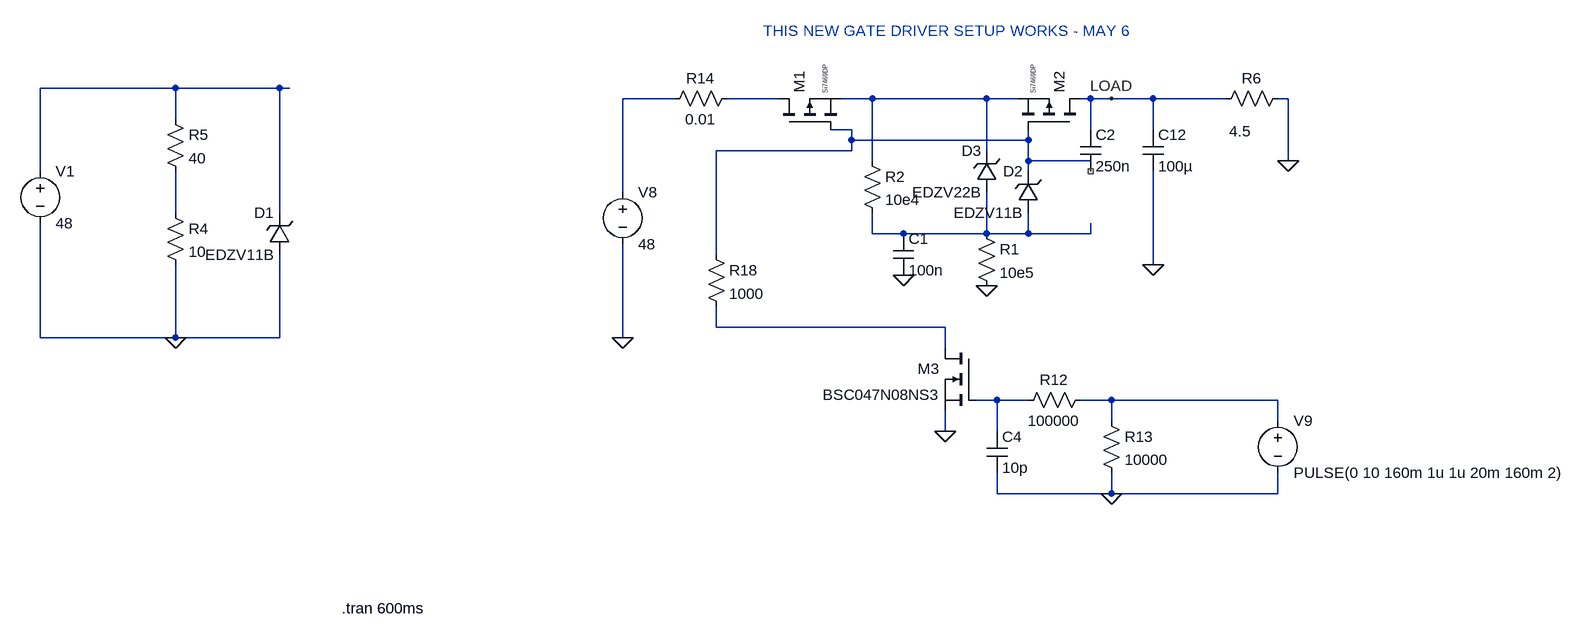
[diagram p0: schematic PMOS Bidirectional Switch Prototype 7.asc]
PMOS Bidirectional Switch Prototype 7.asc, the LTspice schematic file:
Version 4.1
SHEET 1 2720 2516
WIRE -1536 384 -1744 384
WIRE -1376 384 -1536 384
WIRE -1360 384 -1376 384
WIRE -768 400 -848 400
WIRE -608 400 -688 400
WIRE -464 400 -512 400
WIRE -288 400 -464 400
WIRE -240 400 -288 400
WIRE -128 400 -144 400
WIRE -96 400 -128 400
WIRE -32 400 -96 400
WIRE 80 400 -32 400
WIRE 176 400 160 400
WIRE -1536 432 -1536 384
WIRE -496 448 -528 448
WIRE -128 448 -128 400
WIRE -32 448 -32 400
WIRE -496 464 -496 448
WIRE -224 464 -224 448
WIRE -224 464 -496 464
WIRE -496 480 -496 464
WIRE -496 480 -704 480
WIRE -288 480 -288 400
WIRE -464 496 -464 400
WIRE -224 496 -224 464
WIRE -128 496 -224 496
WIRE 176 496 176 400
WIRE -1744 512 -1744 384
WIRE -224 512 -224 496
WIRE -848 544 -848 400
WIRE -1536 576 -1536 512
WIRE -1376 576 -1376 384
WIRE -464 608 -464 576
WIRE -416 608 -464 608
WIRE -288 608 -288 544
WIRE -288 608 -416 608
WIRE -224 608 -224 576
WIRE -224 608 -288 608
WIRE -128 608 -128 592
WIRE -128 608 -224 608
WIRE -704 640 -704 480
WIRE -32 656 -32 512
WIRE -704 752 -704 720
WIRE -352 752 -704 752
WIRE -1744 768 -1744 592
WIRE -1536 768 -1536 656
WIRE -1536 768 -1744 768
WIRE -1376 768 -1376 640
WIRE -1376 768 -1536 768
WIRE -848 768 -848 624
WIRE -352 784 -352 752
WIRE -272 864 -304 864
WIRE -224 864 -272 864
WIRE -96 864 -144 864
WIRE 160 864 -96 864
WIRE -96 896 -96 864
WIRE 160 896 160 864
WIRE -352 912 -352 880
WIRE -272 912 -272 864
WIRE -272 1008 -272 976
WIRE -96 1008 -96 976
WIRE -96 1008 -272 1008
WIRE 160 1008 160 976
WIRE 160 1008 -96 1008
FLAG 176 496 0
FLAG -848 768 0
FLAG -352 912 0
FLAG -96 1008 0
FLAG -96 400 LOAD
FLAG -32 656 0
FLAG -288 688 0
FLAG -416 672 0
FLAG -1536 768 0
SYMBOL res 176 384 R90
WINDOW 0 0 56 VBottom 2
WINDOW 3 51 74 VTop 2
SYMATTR InstName R6
SYMATTR Value 4.5
SYMBOL voltage -848 528 R0
WINDOW 123 0 0 Left 0
WINDOW 39 24 124 Left 2
SYMATTR InstName V8
SYMATTR Value 48
SYMBOL voltage 160 880 R0
WINDOW 123 0 0 Left 0
WINDOW 39 0 0 Left 0
SYMATTR InstName V9
SYMATTR Value PULSE(0 10 160m 1u 1u 20m 160m 2)
SYMBOL res -128 848 R90
WINDOW 0 0 56 VBottom 2
WINDOW 3 32 56 VTop 2
SYMATTR InstName R12
SYMATTR Value 100000
SYMBOL res -112 880 R0
SYMATTR InstName R13
SYMATTR Value 10000
SYMBOL cap -288 912 R0
SYMATTR InstName C4
SYMATTR Value 10p
SYMBOL res -720 624 R0
SYMATTR InstName R18
SYMATTR Value 1000
SYMBOL zener -272 544 R180
WINDOW 0 24 64 Left 2
WINDOW 3 24 0 Left 2
SYMATTR InstName D3
SYMATTR Value EDZV22B
SYMBOL res -672 384 R90
WINDOW 0 0 56 VBottom 2
WINDOW 3 32 56 VTop 2
SYMATTR InstName R14
SYMATTR Value 0.01
SYMBOL pmos -608 448 R270
WINDOW 3 56 72 Left 0
SYMATTR Value Si7469DP
SYMATTR InstName M1
SYMBOL pmos -144 448 M270
WINDOW 3 56 72 Left 0
SYMATTR Value Si7469DP
SYMATTR InstName M2
SYMBOL nmos -304 784 M0
SYMATTR InstName M3
SYMATTR Value BSC047N08NS3
SYMBOL cap -48 448 R0
SYMATTR InstName C12
SYMATTR Value 100µ
SYMATTR SpiceLine Rser=0.05
SYMBOL res -304 592 R0
SYMATTR InstName R1
SYMATTR Value 10e5
SYMBOL cap -432 608 R0
SYMATTR InstName C1
SYMATTR Value 100n
SYMBOL res -480 480 R0
SYMATTR InstName R2
SYMATTR Value 10e4
SYMBOL zener -208 576 R180
WINDOW 0 24 64 Left 2
WINDOW 3 24 0 Left 2
SYMATTR InstName D2
SYMATTR Value EDZV11B
SYMBOL cap -144 448 R0
SYMATTR InstName C2
SYMATTR Value 250n
SYMBOL zener -1360 640 R180
WINDOW 0 24 64 Left 2
WINDOW 3 24 0 Left 2
SYMATTR InstName D1
SYMATTR Value EDZV11B
SYMBOL res -1552 560 R0
SYMATTR InstName R4
SYMATTR Value 10
SYMBOL res -1552 416 R0
SYMATTR InstName R5
SYMATTR Value 40
SYMBOL voltage -1744 496 R0
WINDOW 123 0 0 Left 0
WINDOW 39 24 124 Left 2
SYMATTR InstName V1
SYMATTR Value 48
TEXT -632 296 Left 2 ;THIS NEW GATE DRIVER SETUP WORKS - MAY 6
TEXT -1280 1184 Left 2 !.tran 600ms

The netlist it stands for:
* PMOS Bidirectional Switch Prototype 7.asc
R6 0 LOAD 4.5
V8 N002 0 48
V9 N010 0 PULSE(0 10 160m 1u 1u 20m 160m 2)
R12 N010 N009 100000
R13 N010 0 10000
C4 N009 0 10p
R18 N005 N008 1000
D3 N007 N004 EDZV22B
R14 N003 N002 0.01
M1 N003 N005 N004 N004 Si7469DP
M2 LOAD N005 N004 N004 Si7469DP
M3 N008 N009 0 0 BSC047N08NS3
C12 LOAD 0 100µ Rser=0.05
R1 N007 0 10e5
C1 N007 0 100n
R2 N004 N007 10e4
D2 N007 N005 EDZV11B
C2 LOAD NC_01 250n
D1 0 N001 EDZV11B
R4 N006 0 10
R5 N001 N006 40
V1 N001 0 48
.model D D
.lib standard.dio
.model NMOS NMOS
.model PMOS PMOS
.lib standard.mos
* THIS NEW GATE DRIVER SETUP WORKS - MAY 6
.tran 600ms
.backanno
.end